# Altium schematic sheet 01_Power.SchDoc
size A4
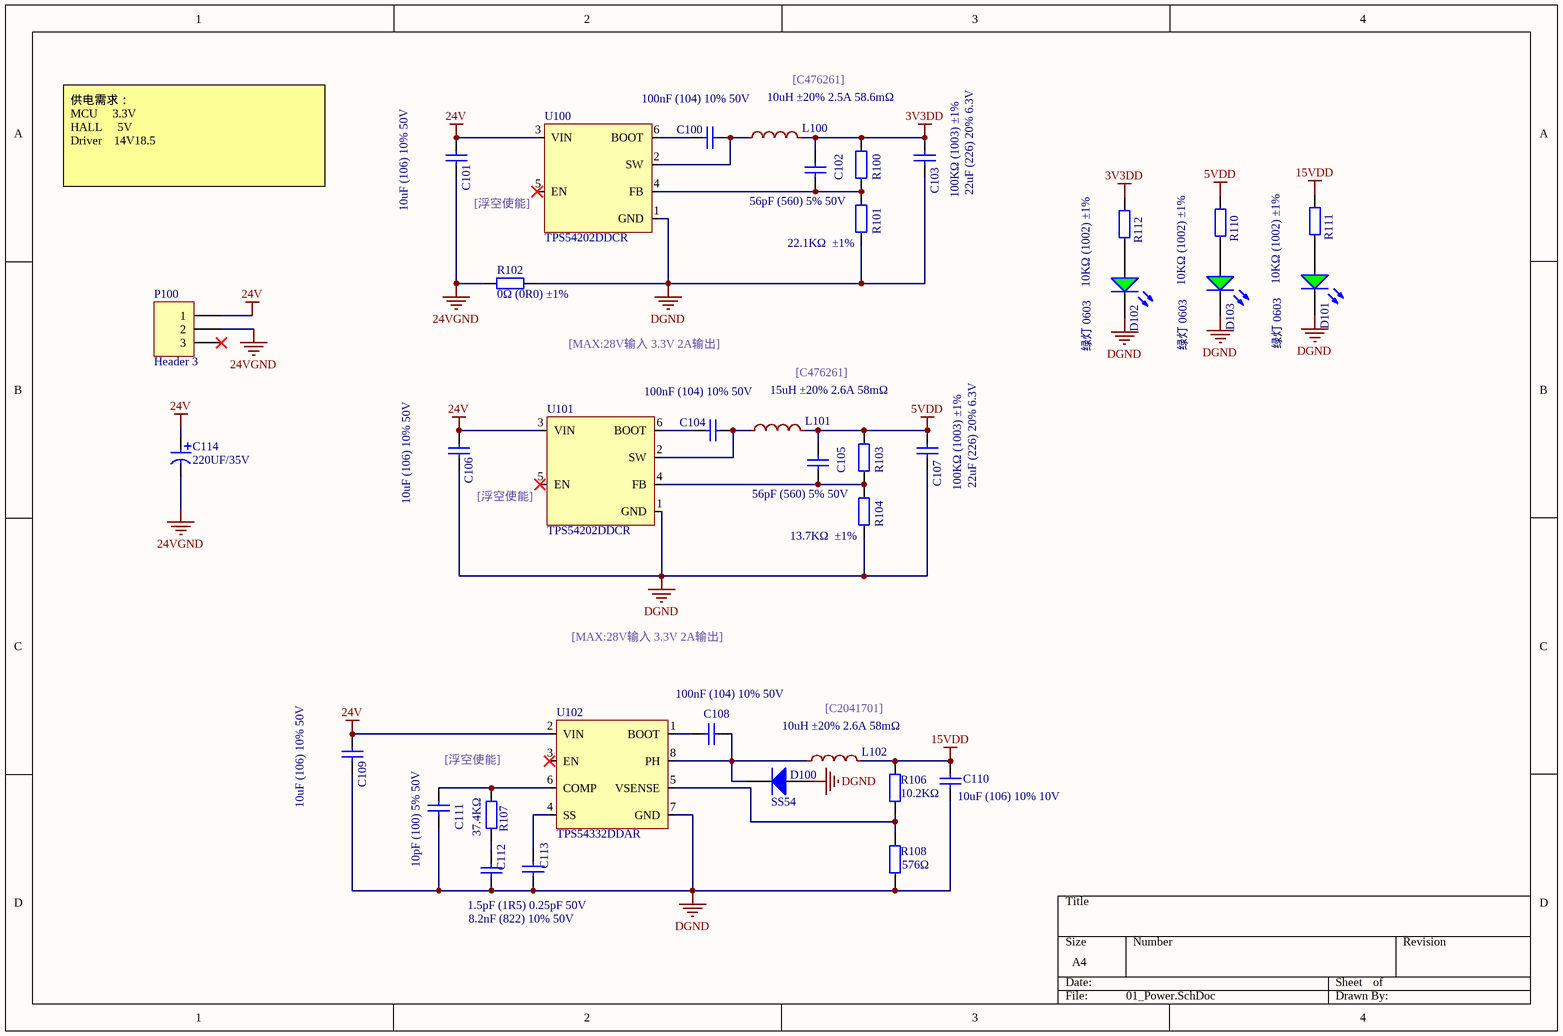
[diagram p0: 01_Power.SchDoc]

## Parts
C100  100nF (104) 10% 50V  [0603_C]
C101  10uF (106) 10% 50V  [0603_C]
C102  56pF (560) 5% 50V  [0603_C]
C103  22uF (226) 20% 6.3V  [0603_C]
C104  100nF (104) 10% 50V  [0603_C]
C105  56pF (560) 5% 50V  [0603_C]
C106  10uF (106) 10% 50V  [0603_C]
C107  22uF (226) 20% 6.3V  [0603_C]
C108  100nF (104) 10% 50V  [0603_C]
C109  10uF (106) 10% 50V  [0603_C]
C110  10uF (106) 10% 10V  [0603_C]
C111  10pF (100) 5% 50V  [0603_C]
C112  1.5pF (1R5) 0.25pF 50V  [0603_C]
C113  8.2nF (822) 10% 50V  [0603_C]
C114  220UF/35V  [CAP_L8.3_W8.3]
D100  SS54  [SMA(DO-214AC)_S1]
D101  绿灯 0603  [0603_LED_S1]
D102  绿灯 0603  [0603_LED_S1]
D103  绿灯 0603  [0603_LED_S1]
L100  10uH ±20% 2.5A 58.6mΩ  [L_SMD_L6_W6]
L101  15uH ±20% 2.6A 58mΩ  [L_SMD_L8_W8]
L102  10uH ±20% 2.6A 58mΩ  [L_SMD_L6_W6]
P100  Header 3  [KF2EDGK-3.81-WI-3P]
R100  100KΩ (1003) ±1%  [0603_R]
R101  22.1KΩ  ±1%  [0603_R]
R102  0Ω (0R0) ±1%  [LC-0805]
R103  100KΩ (1003) ±1%  [0603_R]
R104  13.7KΩ  ±1%  [0603_R]
R106  10.2KΩ  [0603_R]
R107  37.4KΩ  [0603_R]
R108  576Ω  [0603_R]
R110  10KΩ (1002) ±1%  [0603_R]
R111  10KΩ (1002) ±1%  [0603_R]
R112  10KΩ (1002) ±1%  [0603_R]
U100  TPS54202DDCR  [TPS54202DDCR]
U101  TPS54202DDCR  [TPS54202DDCR]
U102  TPS54332DDAR  [TPS54332DDAR]

## Nets
3V3DD: C102.2 C103.2 L100.2 R100.2 R112.2
5VDD: C105.2 C107.2 L101.2 R103.2 R110.2
15VDD: C110.1 L102.2 R106.2 R111.2
24V: C101.2 C106.2 C109.2 C114.1 P100.1 U100.3(VIN) U101.3(VIN) U102.2(VIN)
24VGND: C101.1 C114.2 P100.2 R102.1
DGND: C103.1 C106.1 C107.1 C109.1 C110.2 C111.1 C112.1 C113.1 D100.1(A) D101.K D102.K D103.K R101.1 R102.2 R104.1 R108.1 U100.1(GND) U101.1(GND) U102.7(GND)
NetC100_1: C100.1 U100.6(BOOT)
NetC100_2: C100.2 L100.1 U100.2(SW)
NetC102_1: C102.1 R100.1 R101.2 U100.4(FB)
NetC104_1: C104.1 U101.6(BOOT)
NetC104_2: C104.2 L101.1 U101.2(SW)
NetC105_1: C105.1 R103.1 R104.2 U101.4(FB)
NetC108_1: C108.1 U102.1(BOOT)
NetC108_2: C108.2 D100.2(K) L102.1 U102.8(PH)
NetC111_2: C111.2 R107.2 U102.6(COMP)
NetC112_2: C112.2 R107.1
NetC113_2: C113.2 U102.4(SS)
NetD101_A: D101.A R111.1
NetD102_A: D102.A R112.1
NetD103_A: D103.A R110.1
NetR106_1: R106.1 R108.2 U102.5(VSENSE)

Not connected (* = marked no-connect by the designer): P100 3*; U100 5(EN)*; U101 5(EN)*; U102 3(EN)*

## Notes on the sheet
- [C476261]
- 供电需求：
  MCU     3.3V
  HALL     5V
  Driver    14V18.5
- [浮空使能]
- [MAX:28V输入 3.3V 2A输出]
- [C2041701]

## Library data of the parts
C100 C104 C108 = 0603 100nF (104) 10% 50V: 贴片电容; ComponentLink1Description: 供应商链接; ComponentLink1URL: http://www.szlcsc.com/product/details_15331.html; Package: 0603; Supplier: LC; SuppliersPartNumber: C14663
C101 C106 C109 C110 = 0603 10uF (106) 10% 10V: 贴片电容; ComponentLink1Description: 供应商链接; ComponentLink1URL: http://www.szlcsc.com/product/details_20411.html; Package: 0603; Supplier: LC; SuppliersPartNumber: C19702
C102 C105 = 0603 56pF (560) 5% 50V: 贴片电容; ComponentLink1Description: 供应商链接; ComponentLink1URL: http://www.szlcsc.com/product/details_40131.html; Package: 0603; Supplier: LC; SuppliersPartNumber: C39148
C103 C107 = 0603 22uF (226) 20% 6.3V: 贴片电容; ComponentLink1Description: 供应商链接; ComponentLink1URL: http://www.szlcsc.com/product/details_60514.html; Package: 0603; Supplier: LC; SuppliersPartNumber: C59461
C111 = 0603 10pF (100) 5% 50V: 贴片电容; ComponentLink1Description: 供应商链接; ComponentLink1URL: http://www.szlcsc.com/product/details_1986.html; Package: 0603; Supplier: LC; SuppliersPartNumber: C1634
C112 = 0603 1.5pF (1R5) 0.25pF 50V: 贴片电容; ComponentLink1Description: 供应商链接; ComponentLink1URL: http://www.szlcsc.com/product/details_1991.html; Package: 0603; Supplier: LC; SuppliersPartNumber: C1639
C113 = 0603 8.2nF (822) 10% 50V: 贴片电容; ComponentLink1Description: 供应商链接; ComponentLink1URL: http://www.szlcsc.com/product/details_28670.html; Package: 0603; Supplier: LC; SuppliersPartNumber: C27920
C114 = CAP2: 电解电容
D100 = SMA(DO-214AC) SS54: 二极管; ComponentLink1Description: 供应商链接; ComponentLink1URL: http://www.szlcsc.com/product/details_23178.html; Package: SMA(DO-214AC); Supplier: LC; SuppliersPartNumber: C22452
D101-D103 = 0603 绿灯: 发光二极管; ComponentLink1Description: 供应商链接; ComponentLink1URL: http://www.szlcsc.com/product/details_73152.html; Package: 0603; Supplier: LC; SuppliersPartNumber: C72043
L100-L102 = L
P100 = Header 3: Header, 3-Pin; LatestRevisionDate: 17-Jul-2002; LatestRevisionNote: Re-released for DXP Platform.; Publisher: Altium Limited
R100 R101 R103 R104 = 0603 100KΩ (1003) 1%: 贴片电阻; ComponentLink1Description: 供应商链接; ComponentLink1URL: http://www.szlcsc.com/product/details_26546.html; Package: 0603; Supplier: LC; SuppliersPartNumber: C25803
R102 = 0603 0Ω (0R0) 1%: 贴片电阻; ComponentLink1Description: 供应商链接; ComponentLink1URL: http://www.szlcsc.com/product/details_21903.html; Package: 0603; Supplier: LC; SuppliersPartNumber: C21189
R106-R108 R110-R112 = 0603 10KΩ (1002) 1%: 贴片电阻; ComponentLink1Description: 供应商链接; ComponentLink1URL: http://www.szlcsc.com/product/details_26547.html; Package: 0603; Supplier: LC; SuppliersPartNumber: C25804